# Altium project PCB_Project.PrjPcb
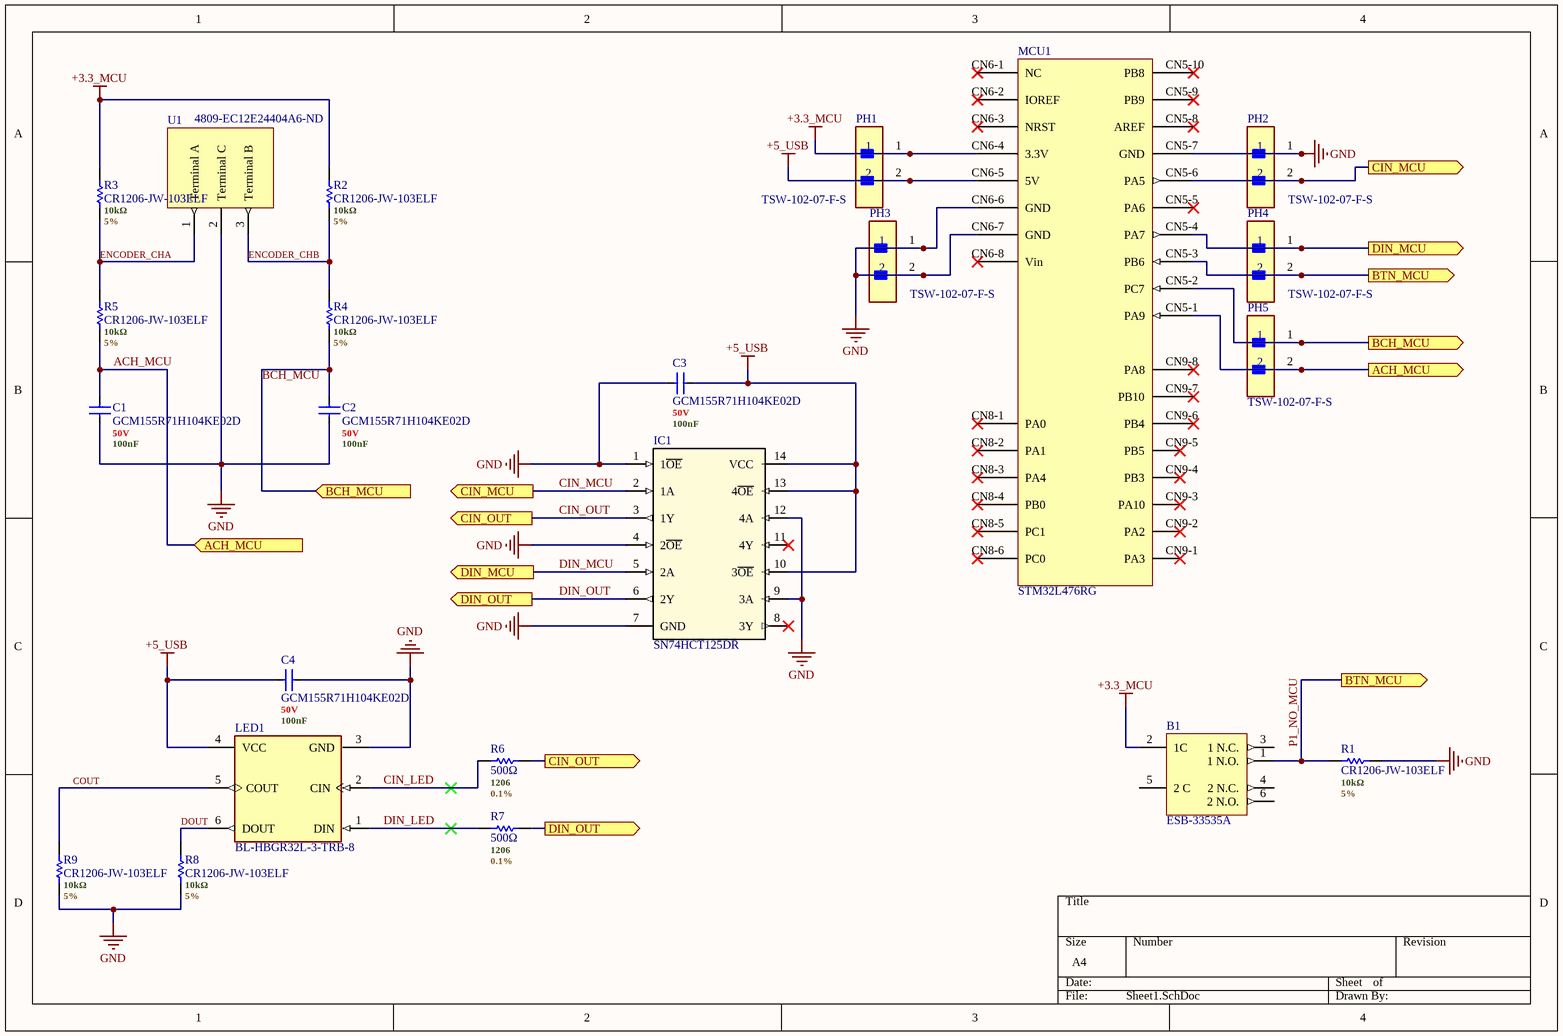
[diagram p0: Sheet1.SchDoc]
1 sheet, 23 parts. Net scope: flat (ports and power ports of the same name join across sheets).
Board files: PCB2.PcbDoc, PCB3.PcbDoc

## Sheet Sheet1.SchDoc
size A4; SheetNumber: 1; SheetTotal: 1

### Parts
B1  ESB-33535A  [SOIC_Boton]
C1  GCM155R71H104KE02D  .Voltage Rating (DC): 50V  .Value: 100nF  [GCM155R71H104KE02D]
C2  GCM155R71H104KE02D  .Voltage Rating (DC): 50V  .Value: 100nF  [GCM155R71H104KE02D]
C3  GCM155R71H104KE02D  .Voltage Rating (DC): 50V  .Value: 100nF  [GCM155R71H104KE02D]
C4  GCM155R71H104KE02D  .Voltage Rating (DC): 50V  .Value: 100nF  [GCM155R71H104KE02D]
IC1  SN74HCT125DR  [SOIC127P600X175_HS-15N - TI]
LED1  BL-HBGR32L-3-TRB-8  [SOIC_LEDRGB]
MCU1  STM32L476RG  [Nucleo_Card]
PH1  TSW-102-07-F-S  [TSW-102-07-F-S]
PH2  TSW-102-07-F-S  [TSW-102-07-F-S]
PH3  TSW-102-07-F-S  [TSW-102-07-F-S]
PH4  TSW-102-07-F-S  [TSW-102-07-F-S]
PH5  TSW-102-07-F-S  [TSW-102-07-F-S]
R1  CR1206-JW-103ELF  .Value: 10kΩ  .Tolerance: 5%  [Chip-Resistor-10k]
R2  CR1206-JW-103ELF  .Value: 10kΩ  .Tolerance: 5%  [Chip-Resistor-10k]
R3  CR1206-JW-103ELF  .Value: 10kΩ  .Tolerance: 5%  [Chip-Resistor-10k]
R4  CR1206-JW-103ELF  .Value: 10kΩ  .Tolerance: 5%  [Chip-Resistor-10k]
R5  CR1206-JW-103ELF  .Value: 10kΩ  .Tolerance: 5%  [Chip-Resistor-10k]
R6  500Ω  .Case/Package: 1206  .Tolerance: 0.1%  [R1206 - YAGEO]
R7  500Ω  .Case/Package: 1206  .Tolerance: 0.1%  [R1206 - YAGEO]
R8  CR1206-JW-103ELF  .Value: 10kΩ  .Tolerance: 5%  [Chip-Resistor-10k]
R9  CR1206-JW-103ELF  .Value: 10kΩ  .Tolerance: 5%  [Chip-Resistor-10k]
U1  4809-EC12E24404A6-ND  [Tray - ALPS Alpine]

### Ports
ACH_MCU (in, see Sheet1[4B]), ACH_MCU (out, see Sheet1[1C]), BCH_MCU (in, see Sheet1[4B]), BCH_MCU (out, see Sheet1[1B]), BTN_MCU (out, see Sheet1[4B]), BTN_MCU (out, see Sheet1[4C]), CIN_MCU (out, see Sheet1[2B]), CIN_MCU (out, see Sheet1[4A]), CIN_OUT (out, see Sheet1[2C]), DIN_MCU (out, see Sheet1[2C]), DIN_MCU (out, see Sheet1[4A]), DIN_OUT (out, see Sheet1[2C]), DIN_OUT (out, see Sheet1[2D])

### Nets
+3.3_MCU: B1.2(1C) MCU1.CN6-4(3.3V) PH1.1 R2.2 R3.2
+5_USB: C3.2(PIN2) C4.1(PIN1) IC1.10(3~{OE}) IC1.13(4~{OE}) IC1.14(VCC) LED1.4(VCC) MCU1.CN6-5(5V) PH1.2
GND: C1.1(PIN1) C2.1(PIN1) C3.1(PIN1) C4.2(PIN2) IC1.1(1~{OE}) IC1.4(2~{OE}) IC1.7(GND) IC1.9(3A) IC1.12(4A) LED1.3(GND) MCU1.CN5-7(GND) MCU1.CN6-6(GND) MCU1.CN6-7(GND) PH2.1 PH3.1 PH3.2 R1.2 R8.1 R9.1 U1.2(Terminal_C)
ACH_MCU: C1.2(PIN2) MCU1.CN5-1(PA9) PH5.2 R5.1 ; port ACH_MCU
BCH_MCU: C2.2(PIN2) MCU1.CN5-2(PC7) PH5.1 R4.1 ; port BCH_MCU
CIN_LED: LED1.2(CIN) R6.1
CIN_MCU: IC1.2(1A) MCU1.CN5-6(PA5) PH2.2 ; port CIN_MCU
CIN_OUT: IC1.3(1Y) R6.2 ; port CIN_OUT
COUT: LED1.5(COUT) R9.2
DIN_LED: LED1.1(DIN) R7.1
DIN_MCU: IC1.5(2A) MCU1.CN5-4(PA7) PH4.1 ; port DIN_MCU
DIN_OUT: IC1.6(2Y) R7.2 ; port DIN_OUT
DOUT: LED1.6(DOUT) R8.2
ENCODER_CHA: R3.1 R5.2 U1.1(Terminal_A)
ENCODER_CHB: R2.1 R4.2 U1.3(Terminal_B)
P1_NO_MCU: B1.1(1_N.O.) MCU1.CN5-3(PB6) PH4.2 R1.1 ; port BTN_MCU

Not connected (* = marked no-connect by the designer): B1 3(1_N.C.) 4(2_N.C.) 5(2_C) 6(2_N.O.); IC1 8(3Y)* 11(4Y)*; MCU1 CN5-5(PA6)* CN5-8(AREF)* CN5-9(PB9)* CN5-10(PB8)* CN6-1(NC)* CN6-2(IOREF)* CN6-3(NRST)* CN6-8(Vin)* CN8-1(PA0)* CN8-2(PA1)* CN8-3(PA4)* CN8-4(PB0)* CN8-5(PC1)* CN8-6(PC0)* CN9-1(PA3)* CN9-2(PA2)* CN9-3(PA10)* CN9-4(PB3)* CN9-5(PB5)* CN9-6(PB4)* CN9-7(PB10)* CN9-8(PA8)*

### Library data of the parts
B1 = ESB-33535A: Pushbutton Switch, DPDT, Momentary, 0.2A, 14VDC, Solder Terminal, Surface Mount-straight; Manufacturer: Panasonic; Actuator Length: 6.5024mm; Contact Current Rating: 200mA; Electrical Life: 10kcycles; Max Voltage Rating (DC): 14V; Operating Force: 4N; Supplier: Avnet; Supplier Part Number: ESB-33535A; Manufacturer Part Number: ESB-33535A; RoHS: Compliant; Category: Pushbutton Switches; Stock: 5400; Pricing: 300=1,46613, 600=1,43739, 1200=1,41701, 2400=1,39721, 4800=1,3745 (USD); Case/Package: SMD/SMT; Height: 6mm; Length: 9.85mm; Lifecycle Status: Production; Max Current Rating: 200mA; Max Operating Temperature: 70°C; Min Operating Temperature: -10°C; Mounting Technology: Surface Mount; Packaging: Tape & Reel; Radiation Hardening: No; Schedule B: 8536509030, 8536509030|8536509030|8536509030|8536509030|8536509030; Termination: Solder; Throw Configuration: DPDT; Voltage Rating (DC): 14V; ComponentLink1URL: https://datasheet.octopart.com:443/ESB33535A-Panasonic-datasheet-93783763.pdf?src-supplier=IHS; ComponentLink1Description: https://datasheet.octopart.com:443/ESB33535A-Panasonic-datasheet-93783763.pdf?src-supplier=IHS; ComponentLink2URL: https://datasheet.octopart.com:443/ESB-33535A-Panasonic-datasheet-138738884.pdf?src-supplier=Electro+Sonic; ComponentLink2Description: https://datasheet.octopart.com:443/ESB-33535A-Panasonic-datasheet-138738884.pdf?src-supplier=Electro+Sonic; Supplier 1: DigiKey; Supplier Part Number 1: P15877SCT-ND
C1-C4 = GCM155R71H104KE02D: 50V 100nF X7R ±10% 0402 Multilayer Ceramic Capacitors MLCC - SMD/SMT ROHS; Manufacturer: Murata; Manufacturer Lifecycle Status: IN PRODUCTION; Supplier: Avnet; Supplier Part Number: GCM155R71H104KE02D; Manufacturer Part Number: GCM155R71H104KE02D; RoHS: Compliant; Category: Ceramic Capacitors; Stock: 8220000; Pricing: 10000=0,00604, 20000=0,00601 (USD); Value: 100nF; Case/Package: 0402; Case Code (Imperial): 0402; Case Code (Metric): 1005; Dielectric: X7R; Dielectric Material: Ceramic; Height: 500µm; Lead Free: Lead Free; Length: 1mm; Lifecycle Status: Production; Material: Ceramic; Max Operating Temperature: 125°C; Min Operating Temperature: -55°C; Mounting Technology: Surface Mount; Number of Terminals: 2; Ratings: AEC-Q200; REACH SVHC: Yes; Schedule B: 8532240020, 8532240020|8532240020, 8532240020|8532240020|8532240020, 8532240020|8532240020|8532240020|8532240020; Termination: SMD/SMT; Tolerance: 10%; Voltage Rating: 50V; Voltage Rating (DC): 50V; Weight: 6.010099mg; Width: 500µm; ComponentLink1URL: https://datasheet.octopart.com:443/GCM155R71H104KE02D-Murata-datasheet-149522465.pdf?src-supplier=Farnell; ComponentLink1Description: https://datasheet.octopart.com:443/GCM155R71H104KE02D-Murata-datasheet-149522465.pdf?src-supplier=Farnell; ComponentLink2URL: https://datasheet.octopart.com:443/GCM155R71H104KE02D-Murata-datasheet-66077033.pdf?src-supplier=element14+APAC; ComponentLink2Description: https://datasheet.octopart.com:443/GCM155R71H104KE02D-Murata-datasheet-66077033.pdf?src-supplier=element14+APAC; ComponentLink3URL: https://datasheet.octopart.com:443/GCM155R71H104KE02D-Murata-datasheet-165579661.pdf?src-supplier=TME; ComponentLink3Description: https://datasheet.octopart.com:443/GCM155R71H104KE02D-Murata-datasheet-165579661.pdf?src-supplier=TME; ComponentLink4URL: https://datasheet.octopart.com:443/GCM155R71H104KE02D-Murata-datasheet-141266224.pdf?src-supplier=Ciiva; ComponentLink4Description: https://datasheet.octopart.com:443/GCM155R71H104KE02D-Murata-datasheet-141266224.pdf?src-supplier=Ciiva; ComponentLink5URL: https://datasheet.octopart.com:443/GCM155R71H104KE02D-Murata-datasheet-140656751.pdf?src-supplier=Ciiva; ComponentLink5Description: https://datasheet.octopart.com:443/GCM155R71H104KE02D-Murata-datasheet-140656751.pdf?src-supplier=Ciiva; ComponentLink6URL: https://datasheet.octopart.com:443/GCM155R71H104KE02D-Murata-datasheet-138716456.pdf?src-supplier=Ciiva; ComponentLink6Description: https://datasheet.octopart.com:443/GCM155R71H104KE02D-Murata-datasheet-138716456.pdf?src-supplier=Ciiva; ComponentLink7URL: https://datasheet.octopart.com:443/GCM155R71H104KE02D-Murata-datasheet-12524712.pdf?src-supplier=Future+Electronics; ComponentLink7Description: https://datasheet.octopart.com:443/GCM155R71H104KE02D-Murata-datasheet-12524712.pdf?src-supplier=Future+Electronics; ComponentLink8URL: http://sigma.octopart.com:80/reach_statement/Murata-company-16.pdf?src-supplier=Compliance+Statements; ComponentLink8Description: http://sigma.octopart.com:80/reach_statement/Murata-company-16.pdf?src-supplier=Compliance+Statements; Supplier 1: DigiKey; Supplier Part Number 1: 490-10672-6-ND
IC1 = SN74HCT125DR: Buffer/Line Driver 4-CH Non-Inverting 3-ST CMOS 14-Pin SOIC T/R / IC BUS BUFF TRI-ST QD 14SOIC; Manufacturer: Texas Instruments; Manufacturer Lifecycle Status: ACTIVE; High Level Output Current: -6mA; Logic Function: Buffer, Inverting; Low Level Output Current: 6mA; Max Supply Voltage: 5.5V; Min Supply Voltage: 4.5V; Nominal Supply Current: 8µA; Number of Bits: 4; Number of Bits per Element: 1; Number of Inputs: 2; Operating Supply Voltage: 5V; Propagation Delay: 33ns; Turn-On Delay Time: 36ns; Supplier: DigiKey; Supplier Part Number: 296-1206-6-ND; Manufacturer Part Number: SN74HCT125DR; RoHS: Compliant; Category: Buffers, Drivers and Transceivers; Stock: 5749; Pricing: 1=0,36, 10=0,246, 25=0,2188, 100=0,1888, 250=0,17452, 500=0,16586, 1000=0,15874 (USD); Ambient Temperature Range High: 85°C; Case/Package: SOIC; Contact Plating: Gold; Height: 0m; Lead Free: Lead Free; Length: 8.65mm; Lifecycle Status: Production; Max Operating Temperature: 85°C; Min Operating Temperature: -40°C; Mounting Technology: Surface Mount; Number of Channels: 4; Number of Circuits: 4; Number of Elements: 4; Number of Input Lines: 4; Number of Output Lines: 4; Number of Outputs: 4; Pins: 14; Packaging: Tape & Reel; Polarity: Non-Inverting; Quiescent Current: 8µA; Radiation Hardening: No; REACH SVHC: No; Schedule B: 8542390000, 8542390000|8542390000|8542390000|8542390000|8542390000; Thickness: 1.58mm; Width: 3.91mm; ComponentLink1URL: https://sigma.octopart.com:443/182471030/technical_drawing/Texas-Instruments-SN74HCT125DR.pdf?src-supplier=Texas+Instruments; ComponentLink1Description: https://sigma.octopart.com:443/182471030/technical_drawing/Texas-Instruments-SN74HCT125DR.pdf?src-supplier=Texas+Instruments; ComponentLink2URL: https://octopart.com:443/opatz8j6/c1?t=kHjRTchamf1OEgcfGdw2KSUhwcpvAKIIc-FB5UHfXFvi1I-d_M1T4R10sj4ifHYz9TGNxLSUoWvIx3SI7rvC9uNSW-SqrDIJNlv8Qi0TmNa75oPoh_peB02lt99knWhhM93-ly3GiWOK9yQWYH3AEwBf5hNp6Gt2W6FXe98KXHBOttL1tX1EWPskv1yBnwYgmAirSOxf7aB0EHO2wQ5lloEzqyiVMuVQecV2n3eHBcjfYdHECec4niyiw3ZzGRWDfKyZzV94Ji-xNpTZfWKfZGH4cl8FZzb-4I3xggn-kiOsM3CTV17eBnzS-uHaZHrzlT18rfC2GREHSFSZiIHnrB4Luqi8FPpUJsgor3JQrJkpNEyuNZHLlpbV8UFZZut-UStbLh2o&src-supplier=Texas+Instruments; ComponentLink2Description: https://octopart.com:443/opatz8j6/c1?t=kHjRTchamf1OEgcfGdw2KSUhwcpvAKIIc-FB5UHfXFvi1I-d_M1T4R10sj4ifHYz9TGNxLSUoWvIx3SI7rvC9uNSW-SqrDIJNlv8Qi0TmNa75oPoh_peB02lt99knWhhM93-ly3GiWOK9yQWYH3AEwBf5hNp6Gt2W6FXe98KXHBOttL1tX1EWPskv1yBnwYgmAirSOxf7aB0EHO2wQ5lloEzqyiVMuVQecV2n3eHBcjfYdHECec4niyiw3ZzGRWDfKyZzV94Ji-xNpTZfWKfZGH4cl8FZzb-4I3xggn-kiOsM3CTV17eBnzS-uHaZHrzlT18rfC2GREHSFSZiIHnrB4Luqi8FPpUJsgor3JQrJkpNEyuNZHLlpbV8UFZZut-UStbLh2o&src-supplier=Texas+Instruments; ComponentLink3URL: https://datasheet.octopart.com:443/SN74HCT125DR-Texas-Instruments-datasheet-27379623.pdf?src-supplier=Texas+Instruments; ComponentLink3Description: https://datasheet.octopart.com:443/SN74HCT125DR-Texas-Instruments-datasheet-27379623.pdf?src-supplier=Texas+Instruments; ComponentLink4URL: https://datasheet.octopart.com:443/SN74HCT125DR-Texas-Instruments-datasheet-10254676.pdf?src-supplier=Texas+Instruments; ComponentLink4Description: https://datasheet.octopart.com:443/SN74HCT125DR-Texas-Instruments-datasheet-10254676.pdf?src-supplier=Texas+Instruments; ComponentLink5URL: https://sigma.octopart.com:443/49249646/technical_drawing/Texas-Instruments-SN74HCT125DR.pdf?src-supplier=Texas+Instruments; ComponentLink5Description: https://sigma.octopart.com:443/49249646/technical_drawing/Texas-Instruments-SN74HCT125DR.pdf?src-supplier=Texas+Instruments; ComponentLink6URL: https://datasheet.octopart.com:443/SN74HCT125DR-Texas-Instruments-datasheet-152071.pdf?src-supplier=Texas+Instruments; ComponentLink6Description: https://datasheet.octopart.com:443/SN74HCT125DR-Texas-Instruments-datasheet-152071.pdf?src-supplier=Texas+Instruments; ComponentLink7URL: https://datasheet.octopart.com:443/SN74HCT125DR-Texas-Instruments-datasheet-148780591.pdf?src-supplier=Upverter; ComponentLink7Description: https://datasheet.octopart.com:443/SN74HCT125DR-Texas-Instruments-datasheet-148780591.pdf?src-supplier=Upverter; ComponentLink8URL: https://datasheet.octopart.com:443/SN74HCT125DR-Texas-Instruments-datasheet-164417431.pdf?src-supplier=SHENGYU+ELECTRONICS; ComponentLink8Description: https://datasheet.octopart.com:443/SN74HCT125DR-Texas-Instruments-datasheet-164417431.pdf?src-supplier=SHENGYU+ELECTRONICS; ComponentLink9URL: https://datasheet.octopart.com:443/SN74HCT125DR-Texas-Instruments-datasheet-14145064.pdf?src-supplier=iiiC; ComponentLink9Description: https://datasheet.octopart.com:443/SN74HCT125DR-Texas-Instruments-datasheet-14145064.pdf?src-supplier=iiiC; ComponentLink10URL: https://datasheet.octopart.com:443/SN74HCT125DR-Texas-Instruments-datasheet-11793522.pdf?src-supplier=Arrow+Electronics; ComponentLink10Description: https://datasheet.octopart.com:443/SN74HCT125DR-Texas-Instruments-datasheet-11793522.pdf?src-supplier=Arrow+Electronics; ComponentLink11URL: https://datasheet.octopart.com:443/SN74HCT125DR-Texas-Instruments-datasheet-8637610.pdf?src-supplier=Verical; ComponentLink11Description: https://datasheet.octopart.com:443/SN74HCT125DR-Texas-Instruments-datasheet-8637610.pdf?src-supplier=Verical; ComponentLink12URL: https://datasheet.octopart.com:443/SN74HCT125DR-Texas-Instruments-datasheet-5321032.pdf?src-supplier=Verical; ComponentLink12Description: https://datasheet.octopart.com:443/SN74HCT125DR-Texas-Instruments-datasheet-5321032.pdf?src-supplier=Verical; ComponentLink13URL: https://datasheet.octopart.com:443/SN74HCT125DR-Texas-Instruments-datasheet-10451259.pdf?src-supplier=Jameco; ComponentLink13Description: https://datasheet.octopart.com:443/SN74HCT125DR-Texas-Instruments-datasheet-10451259.pdf?src-supplier=Jameco; ComponentLink14URL: https://datasheet.octopart.com:443/SN74HCT125DR-Texas-Instruments-datasheet-58090.pdf?src-supplier=DigiKey; ComponentLink14Description: https://datasheet.octopart.com:443/SN74HCT125DR-Texas-Instruments-datasheet-58090.pdf?src-supplier=DigiKey; ComponentLink15URL: https://datasheet.octopart.com:443/SN74HCT125DR-Texas-Instruments-datasheet-114889.pdf?src-supplier=Sierra+IC; ComponentLink15Description: https://datasheet.octopart.com:443/SN74HCT125DR-Texas-Instruments-datasheet-114889.pdf?src-supplier=Sierra+IC; ComponentLink16URL: http://sigma.octopart.com:80/conflict_mineral_statement/Texas-Instruments-company-63.pdf?src-supplier=Compliance+Statements; ComponentLink16Description: http://sigma.octopart.com:80/conflict_mineral_statement/Texas-Instruments-company-63.pdf?src-supplier=Compliance+Statements; ComponentLink17URL: http://sigma.octopart.com:80/reach_statement/Texas-Instruments-company-64.pdf?src-supplier=Compliance+Statements; ComponentLink17Description: http://sigma.octopart.com:80/reach_statement/Texas-Instruments-company-64.pdf?src-supplier=Compliance+Statements; Supplier 1: DigiKey; Supplier Part Number 1: 296-1206-1-ND
LED1 = BL-HBGR32L-3-TRB-8: Address Led Discrete Serial Rgb; Manufacturer: American Bright; Supplier: DigiKey; Supplier Part Number: 2007-BL-HBGR32L-3-TRB-8CT-ND; Manufacturer Part Number: BL-HBGR32L-3-TRB-8; RoHS: Compliant; Category: Optoelectronics; Stock: 52650; Pricing: 1=1,57, 10=1,113, 100=0,8396, 500=0,7184, 1000=0,67881, 2000=0,64526, 3000=0,62806, 5000=0,60866, 7000=0,59712, 10000=0,58587 (USD); ComponentLink1URL: https://datasheet.octopart.com:443/BL-HBGR32L-3-TRB-8-American-Bright-datasheet-182526079.pdf?src-supplier=Future+Electronics; ComponentLink1Description: https://datasheet.octopart.com:443/BL-HBGR32L-3-TRB-8-American-Bright-datasheet-182526079.pdf?src-supplier=Future+Electronics; Supplier 1: DigiKey; Supplier Part Number 1: 2007-BL-HBGR32L-3-TRB-8CT-ND
MCU1 = STM32L476RG: Development Board, STM32L476RG MCU, On-Board STLINK/V2-1, Arduino & ST Morpho Connectivity; Manufacturer: STMicroelectronics; Manufacturer Part Number: NUCLEO-L476RG; Core Architecture: ARM; Evaluation Kit: Yes; Number of Bits: 32; Supplier: Avnet; Supplier Part Number: 55Y3536; RoHS: Compliant; Category: DSPs - Digital Signal Processors; Stock: 227; Pricing: 1=19,83 (USD); Lead Free: Lead Free; Lifecycle Status: Production; REACH SVHC: No; Schedule B: 8473300002|8473300002|8473300002|8473300002|8473300002; ComponentLink1URL: https://datasheet.octopart.com:443/NUCLEO-L476RG-STMicroelectronics-datasheet-44363362.pdf?src-supplier=STMicroelectronics; ComponentLink1Description: https://datasheet.octopart.com:443/NUCLEO-L476RG-STMicroelectronics-datasheet-44363362.pdf?src-supplier=STMicroelectronics; ComponentLink2URL: https://datasheet.octopart.com:443/NUCLEO-L476RG-STMicroelectronics-datasheet-22171324.pdf?src-supplier=STMicroelectronics; ComponentLink2Description: https://datasheet.octopart.com:443/NUCLEO-L476RG-STMicroelectronics-datasheet-22171324.pdf?src-supplier=STMicroelectronics; ComponentLink3URL: https://datasheet.octopart.com:443/NUCLEO-L476RG-STMicroelectronics-datasheet-78838620.pdf?src-supplier=Farnell; ComponentLink3Description: https://datasheet.octopart.com:443/NUCLEO-L476RG-STMicroelectronics-datasheet-78838620.pdf?src-supplier=Farnell; ComponentLink4URL: https://datasheet.octopart.com:443/NUCLEO-L476RG-STMicroelectronics-datasheet-116606905.pdf?src-supplier=ODG+(Origin+Data+Global); ComponentLink4Description: https://datasheet.octopart.com:443/NUCLEO-L476RG-STMicroelectronics-datasheet-116606905.pdf?src-supplier=ODG+(Origin+Data+Global); ComponentLink5URL: https://datasheet.octopart.com:443/NUCLEO-L476RG-STMicroelectronics-datasheet-37114749.pdf?src-supplier=TME; ComponentLink5Description: https://datasheet.octopart.com:443/NUCLEO-L476RG-STMicroelectronics-datasheet-37114749.pdf?src-supplier=TME; Supplier 1: DigiKey; Supplier Part Number 1: 497-15881-ND
PH1-PH5 = TSW-102-07-F-S: 2 Positions Header, Unshrouded Connector 0.100" (2.54mm) Through Hole Gold; Manufacturer: Samtec; Manufacturer Lifecycle Status: PRODUCTION; Connector Type: Male Pin; Gender: Male; Max Current Rating: 7.6A; Max Voltage Rating (AC): 550V; Number of Contacts: 2; Supplier: Avnet; Supplier Part Number: TSW-102-07-F-S; Manufacturer Part Number: TSW-102-07-F-S; RoHS: Compliant; Category: Headers and Wire Housings; Stock: 10000; Pricing: 1=0,10388, 2=0,10335, 4=0,10282, 8=0,10229, 16=0,0768 (USD); Color: Black; Contact Material: Gold, Nickel; Contact Mating Length: 5.842mm; Contact Plating: Gold; Depth: 2.54mm; Height: 8.71mm; Housing Color: Black; Housing Material: Polyester; Lead Pitch: 2.54mm; Lifecycle Status: Production; Max Operating Temperature: 125°C; Min Operating Temperature: -55°C; Mounting Technology: Through Hole; Pins: 2; Number of Positions: 2; Number of Rows: 1; Orientation: Straight; Pitch: 2.54mm; Radiation Hardening: No; REACH SVHC: No; Termination: Solder; Voltage Rating: 550V; ComponentLink1URL: https://datasheet.octopart.com:443/TSW-102-07-F-S-Samtec-datasheet-142046629.pdf?src-supplier=Upverter; ComponentLink1Description: https://datasheet.octopart.com:443/TSW-102-07-F-S-Samtec-datasheet-142046629.pdf?src-supplier=Upverter; ComponentLink2URL: https://sigma.octopart.com:443/14433679/technical_drawing/Samtec-TSW-102-07-F-S.pdf?src-supplier=Upverter; ComponentLink2Description: https://sigma.octopart.com:443/14433679/technical_drawing/Samtec-TSW-102-07-F-S.pdf?src-supplier=Upverter; ComponentLink3URL: https://datasheet.octopart.com:443/TSW-102-07-F-S-Samtec-datasheet-97325576.pdf?src-supplier=Sager+Electronics; ComponentLink3Description: https://datasheet.octopart.com:443/TSW-102-07-F-S-Samtec-datasheet-97325576.pdf?src-supplier=Sager+Electronics; ComponentLink4URL: https://datasheet.octopart.com:443/TSW-102-07-F-S-Samtec-datasheet-151455181.pdf?src-supplier=Sager+Electronics; ComponentLink4Description: https://datasheet.octopart.com:443/TSW-102-07-F-S-Samtec-datasheet-151455181.pdf?src-supplier=Sager+Electronics; ComponentLink5URL: https://sigma.octopart.com:443/97325577/technical_drawing/Samtec-TSW-102-07-F-S.pdf?src-supplier=Samtec; ComponentLink5Description: https://sigma.octopart.com:443/97325577/technical_drawing/Samtec-TSW-102-07-F-S.pdf?src-supplier=Samtec; ComponentLink6URL: https://datasheet.octopart.com:443/TSW-102-07-F-S-Samtec-datasheet-62107121.pdf?src-supplier=Newark; ComponentLink6Description: https://datasheet.octopart.com:443/TSW-102-07-F-S-Samtec-datasheet-62107121.pdf?src-supplier=Newark; ComponentLink7URL: https://datasheet.octopart.com:443/TSW-102-07-F-S-Samtec-datasheet-164324425.pdf?src-supplier=Newark; ComponentLink7Description: https://datasheet.octopart.com:443/TSW-102-07-F-S-Samtec-datasheet-164324425.pdf?src-supplier=Newark; ComponentLink8URL: https://datasheet.octopart.com:443/TSW-102-07-F-S-Samtec-datasheet-11047283.pdf?src-supplier=Newark; ComponentLink8Description: https://datasheet.octopart.com:443/TSW-102-07-F-S-Samtec-datasheet-11047283.pdf?src-supplier=Newark; ComponentLink9URL: https://datasheet.octopart.com:443/TSW-102-07-F-S-Samtec-datasheet-136646178.pdf?src-supplier=Master+Electronics; ComponentLink9Description: https://datasheet.octopart.com:443/TSW-102-07-F-S-Samtec-datasheet-136646178.pdf?src-supplier=Master+Electronics; ComponentLink10URL: https://datasheet.octopart.com:443/TSW-102-07-F-S-Samtec-datasheet-116615235.pdf?src-supplier=Electro+Sonic; ComponentLink10Description: https://datasheet.octopart.com:443/TSW-102-07-F-S-Samtec-datasheet-116615235.pdf?src-supplier=Electro+Sonic; ComponentLink11URL: https://datasheet.octopart.com:443/TSW-102-07-F-S-Samtec-datasheet-182948906.pdf?src-supplier=JRH+Electronics; ComponentLink11Description: https://datasheet.octopart.com:443/TSW-102-07-F-S-Samtec-datasheet-182948906.pdf?src-supplier=JRH+Electronics; ComponentLink12URL: https://datasheet.octopart.com:443/TSW-102-07-F-S-Samtec-datasheet-160657603.pdf?src-supplier=Toby+Electronics; ComponentLink12Description: https://datasheet.octopart.com:443/TSW-102-07-F-S-Samtec-datasheet-160657603.pdf?src-supplier=Toby+Electronics; ComponentLink13URL: https://datasheet.octopart.com:443/TSW-102-07-F-S-Samtec-datasheet-116539033.pdf?src-supplier=Toby+Electronics; ComponentLink13Description: https://datasheet.octopart.com:443/TSW-102-07-F-S-Samtec-datasheet-116539033.pdf?src-supplier=Toby+Electronics; ComponentLink14URL: https://datasheet.octopart.com:443/TSW-102-07-F-S-Samtec-datasheet-116536310.pdf?src-supplier=Toby+Electronics; ComponentLink14Description: https://datasheet.octopart.com:443/TSW-102-07-F-S-Samtec-datasheet-116536310.pdf?src-supplier=Toby+Electronics; ComponentLink15URL: https://datasheet.octopart.com/TSW-102-07-F-S-Samtec-datasheet-86818365.pdf; ComponentLink15Description: https://datasheet.octopart.com/TSW-102-07-F-S-Samtec-datasheet-86818365.pdf; Supplier 1: DigiKey; Supplier Part Number 1: SAM10844-ND
R1-R5 R8 R9 = CR1206-JW-103ELF: SMD Chip Resistor, 10 kOhm, ± 5%, 250 mW, 1206 [3216 Metric], Thick Film, General Purpose; Manufacturer: Vishay; Manufacturer Part Number: CRCW120610K0JNEA; Power Dissipation: 250mW; Value: 10kΩ; Temperature Coefficient: 200ppm/°C; Voltage Rating: 200V; Supplier: Avnet; Supplier Part Number: CRCW120610K0JNEA; RoHS: Compliant; Category: Chip SMD Resistors; Stock: 700000; Pricing: 5000=0,00338 (USD); Case/Package: 1206; Case Code (Imperial): 1206; Case Code (Metric): 3216; China RoHS: Non-Compliant; Composition: Thick Film; Contact Plating: Tin; Depth: 1.6mm; Height: 550µm; Lead Free: Lead Free; Length: 3.2mm; Lifecycle Status: Production; Max Operating Temperature: 155°C; Military Standard: Not; Min Operating Temperature: -55°C; Mounting Technology: Surface Mount; Pins: 2; Number of Terminals: 2; Packaging: Cut Tape; Power Rating: 250mW; Radiation Hardening: No; REACH SVHC: Yes; Schedule B: 8533210045, 8533210045|8533210045|8533210045|8533210045|8533210045|8533210045|8533210045|8533210045|8533210045, 8533210045|8533210045|8533210045|8533210045|8533210045|8533210045|8533210045|8533210045|8533210045|8533210045, 8533210045|8533210045|8533210045|8533210045|8533210045|8533210045|8533210045|8533210045|8533210045|8533210045|8533210045; Termination: SMD/SMT; Tolerance: 5%; Voltage Rating (DC): 200V; Weight: 10.007382mg; Width: 1.6mm; Working Voltage: 200V; ComponentLink1URL: https://datasheet.octopart.com:443/CRCW120610K0JNEA-Vishay-datasheet-175423584.pdf?src-supplier=IHS; ComponentLink1Description: https://datasheet.octopart.com:443/CRCW120610K0JNEA-Vishay-datasheet-175423584.pdf?src-supplier=IHS; ComponentLink2URL: https://datasheet.octopart.com:443/CRCW120610K0JNEA-Vishay-datasheet-83961561.pdf?src-supplier=Newark; ComponentLink2Description: https://datasheet.octopart.com:443/CRCW120610K0JNEA-Vishay-datasheet-83961561.pdf?src-supplier=Newark; ComponentLink3URL: https://datasheet.octopart.com:443/CRCW120610K0JNEA-Vishay-datasheet-41302739.pdf?src-supplier=Newark; ComponentLink3Description: https://datasheet.octopart.com:443/CRCW120610K0JNEA-Vishay-datasheet-41302739.pdf?src-supplier=Newark; ComponentLink4URL: https://datasheet.octopart.com:443/CRCW120610K0JNEA-Vishay-datasheet-21268114.pdf?src-supplier=Newark; ComponentLink4Description: https://datasheet.octopart.com:443/CRCW120610K0JNEA-Vishay-datasheet-21268114.pdf?src-supplier=Newark; ComponentLink5URL: https://datasheet.octopart.com:443/CRCW120610K0JNEA-Vishay-datasheet-21226360.pdf?src-supplier=Newark; ComponentLink5Description: https://datasheet.octopart.com:443/CRCW120610K0JNEA-Vishay-datasheet-21226360.pdf?src-supplier=Newark; ComponentLink6URL: https://datasheet.octopart.com:443/CRCW120610K0JNEA-Vishay-datasheet-62317937.pdf?src-supplier=element14+APAC; ComponentLink6Description: https://datasheet.octopart.com:443/CRCW120610K0JNEA-Vishay-datasheet-62317937.pdf?src-supplier=element14+APAC; ComponentLink7URL: https://datasheet.octopart.com:443/CRCW120610K0JNEA-Vishay-datasheet-66077789.pdf?src-supplier=element14+APAC; ComponentLink7Description: https://datasheet.octopart.com:443/CRCW120610K0JNEA-Vishay-datasheet-66077789.pdf?src-supplier=element14+APAC; ComponentLink8URL: https://datasheet.octopart.com:443/CRCW120610K0JNEA-Vishay-datasheet-14722531.pdf?src-supplier=element14+APAC; ComponentLink8Description: https://datasheet.octopart.com:443/CRCW120610K0JNEA-Vishay-datasheet-14722531.pdf?src-supplier=element14+APAC; ComponentLink9URL: https://datasheet.octopart.com:443/CRCW120610K0JNEA-Vishay-Dale-datasheet-41169522.pdf?src-supplier=element14+APAC; ComponentLink9Description: https://datasheet.octopart.com:443/CRCW120610K0JNEA-Vishay-Dale-datasheet-41169522.pdf?src-supplier=element14+APAC; ComponentLink10URL: https://datasheet.octopart.com:443/CRCW120610K0JNEA-Vishay-datasheet-41195454.pdf?src-supplier=Farnell; ComponentLink10Description: https://datasheet.octopart.com:443/CRCW120610K0JNEA-Vishay-datasheet-41195454.pdf?src-supplier=Farnell; ComponentLink11URL: https://datasheet.octopart.com:443/CRCW120610K0JNEA-Vishay-datasheet-13242068.pdf?src-supplier=Farnell; ComponentLink11Description: https://datasheet.octopart.com:443/CRCW120610K0JNEA-Vishay-datasheet-13242068.pdf?src-supplier=Farnell; ComponentLink12URL: https://datasheet.octopart.com:443/CRCW120610K0JNEA-Vishay-datasheet-13195083.pdf?src-supplier=Farnell; ComponentLink12Description: https://datasheet.octopart.com:443/CRCW120610K0JNEA-Vishay-datasheet-13195083.pdf?src-supplier=Farnell; ComponentLink13URL: https://datasheet.octopart.com:443/CRCW120610K0JNEA-Vishay-datasheet-13034211.pdf?src-supplier=Farnell; ComponentLink13Description: https://datasheet.octopart.com:443/CRCW120610K0JNEA-Vishay-datasheet-13034211.pdf?src-supplier=Farnell; ComponentLink14URL: https://datasheet.octopart.com:443/CRCW120610K0JNEA-Vishay-datasheet-12600034.pdf?src-supplier=Farnell; ComponentLink14Description: https://datasheet.octopart.com:443/CRCW120610K0JNEA-Vishay-datasheet-12600034.pdf?src-supplier=Farnell; ComponentLink15URL: https://datasheet.octopart.com:443/CRCW120610K0JNEA-Vishay-datasheet-12532161.pdf?src-supplier=Farnell; ComponentLink15Description: https://datasheet.octopart.com:443/CRCW120610K0JNEA-Vishay-datasheet-12532161.pdf?src-supplier=Farnell; ComponentLink16URL: https://datasheet.octopart.com:443/CRCW120610K0JNEA-Vishay-datasheet-12517896.pdf?src-supplier=Farnell; ComponentLink16Description: https://datasheet.octopart.com:443/CRCW120610K0JNEA-Vishay-datasheet-12517896.pdf?src-supplier=Farnell; ComponentLink17URL: https://datasheet.octopart.com:443/CRCW120610K0JNEA-Vishay-datasheet-12509762.pdf?src-supplier=Farnell; ComponentLink17Description: https://datasheet.octopart.com:443/CRCW120610K0JNEA-Vishay-datasheet-12509762.pdf?src-supplier=Farnell; ComponentLink18URL: https://datasheet.octopart.com:443/CRCW120610K0JNEA-Vishay-datasheet-10322335.pdf?src-supplier=Farnell; ComponentLink18Description: https://datasheet.octopart.com:443/CRCW120610K0JNEA-Vishay-datasheet-10322335.pdf?src-supplier=Farnell; ComponentLink19URL: https://datasheet.octopart.com:443/CRCW120610K0JNEA-Vishay-datasheet-8788789.pdf?src-supplier=Farnell; ComponentLink19Description: https://datasheet.octopart.com:443/CRCW120610K0JNEA-Vishay-datasheet-8788789.pdf?src-supplier=Farnell; ComponentLink20URL: https://datasheet.octopart.com:443/CRCW120610K0JNEA-Vishay-datasheet-8361388.pdf?src-supplier=Farnell; ComponentLink20Description: https://datasheet.octopart.com:443/CRCW120610K0JNEA-Vishay-datasheet-8361388.pdf?src-supplier=Farnell; ComponentLink21URL: https://datasheet.octopart.com:443/CRCW120610K0JNEA-Vishay-datasheet-546287.pdf?src-supplier=Farnell; ComponentLink21Description: https://datasheet.octopart.com:443/CRCW120610K0JNEA-Vishay-datasheet-546287.pdf?src-supplier=Farnell; ComponentLink22URL: https://datasheet.octopart.com:443/CRCW120610K0JNEA-Vishay-datasheet-5300368.pdf?src-supplier=Future+Electronics; ComponentLink22Description: https://datasheet.octopart.com:443/CRCW120610K0JNEA-Vishay-datasheet-5300368.pdf?src-supplier=Future+Electronics; ComponentLink23URL: https://datasheet.octopart.com:443/CRCW120610K0JNEA-Vishay-datasheet-62316122.pdf?src-supplier=Future+Electronics; ComponentLink23Description: https://datasheet.octopart.com:443/CRCW120610K0JNEA-Vishay-datasheet-62316122.pdf?src-supplier=Future+Electronics; ComponentLink24URL: https://datasheet.octopart.com:443/CRCW120610K0JNEA-Vishay-datasheet-5306405.pdf?src-supplier=RS+(Formerly+Allied+Electronics); ComponentLink24Description: https://datasheet.octopart.com:443/CRCW120610K0JNEA-Vishay-datasheet-5306405.pdf?src-supplier=RS+(Formerly+Allied+Electronics); ComponentLink25URL: https://datasheet.octopart.com:443/CRCW120610K0JNEA-Vishay-Dale-datasheet-47688880.pdf?src-supplier=RS+(Formerly+Allied+Electronics); ComponentLink25Description: https://datasheet.octopart.com:443/CRCW120610K0JNEA-Vishay-Dale-datasheet-47688880.pdf?src-supplier=RS+(Formerly+Allied+Electronics); ComponentLink26URL: https://datasheet.octopart.com:443/CRCW120610K0JNEA-Vishay-datasheet-12001583.pdf?src-supplier=RS+(Formerly+Allied+Electronics); ComponentLink26Description: https://datasheet.octopart.com:443/CRCW120610K0JNEA-Vishay-datasheet-12001583.pdf?src-supplier=RS+(Formerly+Allied+Electronics); ComponentLink27URL: https://datasheet.octopart.com:443/CRCW120610K0JNEA-Vishay-datasheet-17834126.pdf?src-supplier=TME; ComponentLink27Description: https://datasheet.octopart.com:443/CRCW120610K0JNEA-Vishay-datasheet-17834126.pdf?src-supplier=TME; ComponentLink28URL: https://datasheet.octopart.com/D-CRCW-e3-Standard-Thick-Film-Chip-Resistors-Vishay-datasheet-family-64.pdf; ComponentLink28Description: https://datasheet.octopart.com/D-CRCW-e3-Standard-Thick-Film-Chip-Resistors-Vishay-datasheet-family-64.pdf; ComponentLink29URL: https://datasheet.octopart.com:443/CRCW120610K0JNEA-Vishay-datasheet-8445837.pdf?src-supplier=element14; ComponentLink29Description: https://datasheet.octopart.com:443/CRCW120610K0JNEA-Vishay-datasheet-8445837.pdf?src-supplier=element14; ComponentLink30URL: https://datasheet.octopart.com:443/CRCW120610K0JNEA-Vishay-datasheet-5377184.pdf?src-supplier=Garrett; ComponentLink30Description: https://datasheet.octopart.com:443/CRCW120610K0JNEA-Vishay-datasheet-5377184.pdf?src-supplier=Garrett; ComponentLink31URL: https://datasheet.octopart.com:443/CRCW120610K0JNEA-Vishay-datasheet-148188.pdf?src-supplier=Garrett; ComponentLink31Description: https://datasheet.octopart.com:443/CRCW120610K0JNEA-Vishay-datasheet-148188.pdf?src-supplier=Garrett; ComponentLink32URL: https://datasheet.octopart.com:443/CRCW120610K0JNEA-Vishay-datasheet-41916.pdf?src-supplier=Garrett; ComponentLink32Description: https://datasheet.octopart.com:443/CRCW120610K0JNEA-Vishay-datasheet-41916.pdf?src-supplier=Garrett; ComponentLink33URL: http://sigma.octopart.com:80/rohs_certificate/D-CRCW-e3-Standard-Thick-Film-Chip-Resistors-Vishay-family-102.pdf?src-supplier=Compliance+Statements; ComponentLink33Description: http://sigma.octopart.com:80/rohs_certificate/D-CRCW-e3-Standard-Thick-Film-Chip-Resistors-Vishay-family-102.pdf?src-supplier=Compliance+Statements; Features: Moisture Resistant; Max Power Dissipation: 250mW; Number of Terminations: 2; ComponentLink34URL: https://datasheet.octopart.com:443/CR1206-JW-103ELF-Bourns-datasheet-159578630.pdf?src-supplier=IHS; ComponentLink34Description: https://datasheet.octopart.com:443/CR1206-JW-103ELF-Bourns-datasheet-159578630.pdf?src-supplier=IHS; ComponentLink35URL: https://datasheet.octopart.com:443/CR1206-JW-103ELF-Bourns-datasheet-181955239.pdf?src-supplier=IHS; ComponentLink35Description: https://datasheet.octopart.com:443/CR1206-JW-103ELF-Bourns-datasheet-181955239.pdf?src-supplier=IHS; ComponentLink36URL: https://datasheet.octopart.com:443/CR1206-JW-103ELF-Bourns-datasheet-68301634.pdf?src-supplier=element14+APAC; ComponentLink36Description: https://datasheet.octopart.com:443/CR1206-JW-103ELF-Bourns-datasheet-68301634.pdf?src-supplier=element14+APAC; ComponentLink37URL: https://datasheet.octopart.com:443/CR1206-JW-103ELF-Bourns-datasheet-49799764.pdf?src-supplier=element14+APAC; ComponentLink37Description: https://datasheet.octopart.com:443/CR1206-JW-103ELF-Bourns-datasheet-49799764.pdf?src-supplier=element14+APAC; ComponentLink38URL: https://datasheet.octopart.com:443/CR1206-JW-103ELF.-Bourns-datasheet-45190937.pdf?src-supplier=element14+APAC; ComponentLink38Description: https://datasheet.octopart.com:443/CR1206-JW-103ELF.-Bourns-datasheet-45190937.pdf?src-supplier=element14+APAC; ComponentLink39URL: https://datasheet.octopart.com:443/CR1206-JW-103ELF.-Bourns-datasheet-62114779.pdf?src-supplier=element14+APAC; ComponentLink39Description: https://datasheet.octopart.com:443/CR1206-JW-103ELF.-Bourns-datasheet-62114779.pdf?src-supplier=element14+APAC; ComponentLink40URL: https://datasheet.octopart.com:443/CR1206-JW-103ELF.-Bourns-datasheet-34229249.pdf?src-supplier=element14+APAC; ComponentLink40Description: https://datasheet.octopart.com:443/CR1206-JW-103ELF.-Bourns-datasheet-34229249.pdf?src-supplier=element14+APAC; ComponentLink41URL: https://datasheet.octopart.com/CR1206-JW-103ELF-Bourns-datasheet-5318152.pdf; ComponentLink41Description: https://datasheet.octopart.com/CR1206-JW-103ELF-Bourns-datasheet-5318152.pdf; ComponentLink42URL: https://datasheet.octopart.com:443/CR1206-JW-103ELF-Bourns-datasheet-154729663.pdf?src-supplier=Electro+Sonic; ComponentLink42Description: https://datasheet.octopart.com:443/CR1206-JW-103ELF-Bourns-datasheet-154729663.pdf?src-supplier=Electro+Sonic; ComponentLink43URL: https://datasheet.octopart.com:443/CR1206-JW-103ELF-Bourns-datasheet-11547086.pdf?src-supplier=Electro+Sonic; ComponentLink43Description: https://datasheet.octopart.com:443/CR1206-JW-103ELF-Bourns-datasheet-11547086.pdf?src-supplier=Electro+Sonic; ComponentLink44URL: https://datasheet.octopart.com:443/CR1206-JW-103ELF-Bourns-datasheet-28808732.pdf?src-supplier=Farnell; ComponentLink44Description: https://datasheet.octopart.com:443/CR1206-JW-103ELF-Bourns-datasheet-28808732.pdf?src-supplier=Farnell; ComponentLink45URL: https://datasheet.octopart.com:443/CR1206-JW-103ELF-Bourns-datasheet-24895818.pdf?src-supplier=Farnell; ComponentLink45Description: https://datasheet.octopart.com:443/CR1206-JW-103ELF-Bourns-datasheet-24895818.pdf?src-supplier=Farnell; ComponentLink46URL: https://datasheet.octopart.com:443/CR1206-JW-103ELF-Bourns-datasheet-22971629.pdf?src-supplier=Farnell; ComponentLink46Description: https://datasheet.octopart.com:443/CR1206-JW-103ELF-Bourns-datasheet-22971629.pdf?src-supplier=Farnell; ComponentLink47URL: https://datasheet.octopart.com:443/CR1206-JW-103ELF.-Bourns-datasheet-41232171.pdf?src-supplier=Farnell; ComponentLink47Description: https://datasheet.octopart.com:443/CR1206-JW-103ELF.-Bourns-datasheet-41232171.pdf?src-supplier=Farnell; ComponentLink48URL: https://datasheet.octopart.com:443/CR1206-JW-103ELF-Bourns-datasheet-137067991.pdf?src-supplier=X-ON; ComponentLink48Description: https://datasheet.octopart.com:443/CR1206-JW-103ELF-Bourns-datasheet-137067991.pdf?src-supplier=X-ON; ComponentLink49URL: https://datasheet.octopart.com:443/CR1206-JW-103ELF-Bourns-datasheet-140567134.pdf?src-supplier=Arrow.cn; ComponentLink49Description: https://datasheet.octopart.com:443/CR1206-JW-103ELF-Bourns-datasheet-140567134.pdf?src-supplier=Arrow.cn; ComponentLink50URL: http://sigma.octopart.com:80/conflict_mineral_statement/Bourns-company-36.pdf?src-supplier=Compliance+Statements; ComponentLink50Description: http://sigma.octopart.com:80/conflict_mineral_statement/Bourns-company-36.pdf?src-supplier=Compliance+Statements; Supplier 1: DigiKey; Supplier Part Number 1: CR1206-JW-103ELFCT-ND
R6 R7 = RESISTOR - GENERIC: Res Thin Film 1206 500 Ohm 0.1% 0.125W ±5ppm/°C Molded SMD Paper T/R; Manufacturer: Stackpole Electronics; Manufacturer Part Number: RNCF1206BKY500R; Max Power Dissipation: 250mW; Power Rating: 125mW; Working Voltage: 150V; .Date: 050325; Supplier: Avnet; Supplier Part Number: RNCF1206BKY500R; RoHS: Compliant; Category: Chip SMD Resistors; Stock: 1000; Pricing: 1000=1.35429, 2000=1.28108, 4000=1.24737, 6000=1.21539, 8000=1.185 (USD); Case/Package: 1206; Composition: Thin Film; Features: Moisture Resistant; Height: 550µm; Length: 3.2004mm; Lifecycle Status: Production; Max Operating Temperature: 155°C; Min Operating Temperature: -55°C; Mounting Technology: Surface Mount; Number of Terminals: 2; Number of Terminations: 2; Packaging: Tape & Reel (TR); Power Dissipation: 250mW; REACH SVHC: Yes; Value: 500Ω; Temperature Coefficient: 5ppm/°C; Tolerance: 0.1%; Width: 1.55mm; ComponentLink1URL: https://datasheet.octopart.com:443/RNCF1206BKY500R-Stackpole-Electronics-datasheet-170576579.pdf?src-supplier=IHS; ComponentLink1Description: https://datasheet.octopart.com:443/RNCF1206BKY500R-Stackpole-Electronics-datasheet-170576579.pdf?src-supplier=IHS; ComponentLink2URL: https://datasheet.octopart.com:443/RNCF1206BKY500R-Stackpole-Electronics-datasheet-141158876.pdf?src-supplier=Future+Electronics; ComponentLink2Description: https://datasheet.octopart.com:443/RNCF1206BKY500R-Stackpole-Electronics-datasheet-141158876.pdf?src-supplier=Future+Electronics; ComponentLink3URL: https://datasheet.octopart.com:443/RNCF1206BKY500R-Stackpole-Electronics-datasheet-28504821.pdf?src-supplier=Future+Electronics; ComponentLink3Description: https://datasheet.octopart.com:443/RNCF1206BKY500R-Stackpole-Electronics-datasheet-28504821.pdf?src-supplier=Future+Electronics; ComponentLink4URL: https://datasheet.octopart.com:443/RNCF1206BKY500R-Stackpole-Electronics-datasheet-12511394.pdf?src-supplier=Stackpole+Electronics; ComponentLink4Description: https://datasheet.octopart.com:443/RNCF1206BKY500R-Stackpole-Electronics-datasheet-12511394.pdf?src-supplier=Stackpole+Electronics; ComponentLink5URL: https://datasheet.octopart.com/RNCF1206BKY500R-Stackpole-Electronics-datasheet-11755897.pdf; ComponentLink5Description: https://datasheet.octopart.com/RNCF1206BKY500R-Stackpole-Electronics-datasheet-11755897.pdf; ComponentLink6URL: http://sigma.octopart.com:80/15941409/materials_sheet/Stackpole-Electronics-RNCF1206BKY500R.pdf?src-supplier=Compliance+Statements; ComponentLink6Description: http://sigma.octopart.com:80/15941409/materials_sheet/Stackpole-Electronics-RNCF1206BKY500R.pdf?src-supplier=Compliance+Statements; ComponentLink7URL: http://sigma.octopart.com:80/141158212/rohs_statement/Stackpole-Electronics-RNCF1206BKY500R.pdf?src-supplier=Compliance+Statements; ComponentLink7Description: http://sigma.octopart.com:80/141158212/rohs_statement/Stackpole-Electronics-RNCF1206BKY500R.pdf?src-supplier=Compliance+Statements; ComponentLink8URL: http://sigma.octopart.com:80/141158211/reach_statement/Stackpole-Electronics-RNCF1206BKY500R.pdf?src-supplier=Compliance+Statements; ComponentLink8Description: http://sigma.octopart.com:80/141158211/reach_statement/Stackpole-Electronics-RNCF1206BKY500R.pdf?src-supplier=Compliance+Statements; Supplier 1: DigiKey; Supplier Part Number 1: 738-RNCF1206BKY500RCT-ND
U1 = 4809-EC12E24404A6-ND: Rotary Position Encoder, Single, 2 Channels; Manufacturer: ALPS; Built in Switch: No; Hole Diameter: 2mm; Number of Channels: 2; Number of Circuits: 1; Operating Supply Voltage: 5V; Pulses per Revolution: 24; Supplier: DigiKey; Supplier Part Number: 4809-EC12E24404A6-ND; Manufacturer Part Number: EC12E24404A6; RoHS: Compliant; Category: Sensors; Stock: 2128; Pricing: 1=2,36, 5=2,026, 10=1,898, 25=1,74, 40=1,66425, 80=1,55838, 230=1,40943, 440=1,32475, 945=1,23103 (USD); Lifecycle Status: Production; Max Operating Temperature: 70°C; Min Operating Temperature: -10°C; Mounting Technology: Through Hole; Radiation Hardening: No; REACH SVHC: No; Termination: Solder; ComponentLink1URL: https://datasheet.octopart.com:443/EC12E24404A6-ALPS-datasheet-181954823.pdf?src-supplier=IHS; ComponentLink1Description: https://datasheet.octopart.com:443/EC12E24404A6-ALPS-datasheet-181954823.pdf?src-supplier=IHS; ComponentLink2URL: https://datasheet.octopart.com:443/EC12E24404A6-ALPS-datasheet-27704593.pdf?src-supplier=IHS; ComponentLink2Description: https://datasheet.octopart.com:443/EC12E24404A6-ALPS-datasheet-27704593.pdf?src-supplier=IHS; Supplier 1: DigiKey; Supplier Part Number 1: 4809-EC12E24404A6-ND